# EAGLE design oshi-fuse-board-mk-2_5x20mm (EAGLE 6.5.0)
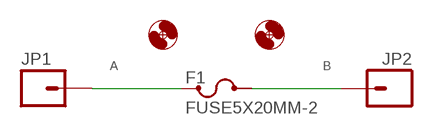
[diagram p0: schematic, sheet 1]

## Parts
F1  FUSE5X20MM-2  [FUSE-2AG]
H1  HOLE#2  [HOLE-#2]
H2  HOLE#2  [HOLE-#2]
JP1  M01SCREWITGOOD  [1X01-RING-TERM-6-32-FAT]
JP2  M01SCREWITGOOD  [1X01-RING-TERM-6-32-FAT]

## Nets
A: F1.1 F1.1@1 JP1.P$1 JP1.P$2 JP1.P$3 JP1.P$4
B: F1.2 F1.2@2 JP2.P$1 JP2.P$2 JP2.P$3 JP2.P$4

## Library data of the parts
F1 = A_butts:FUSE
H1 H2 = A_butts:HOLE: MOUNTING HOLE with drill center marker
JP1 JP2 = A_butts:M01: Header 1 Standard 1-pin 0.1" header. Use with straight break away headers (SKU : PRT-00116), right angle break away headers (PRT-00553), swiss pins (PRT-00743), machine pins (PRT-00117), and female headers (PRT-00115).

## Board
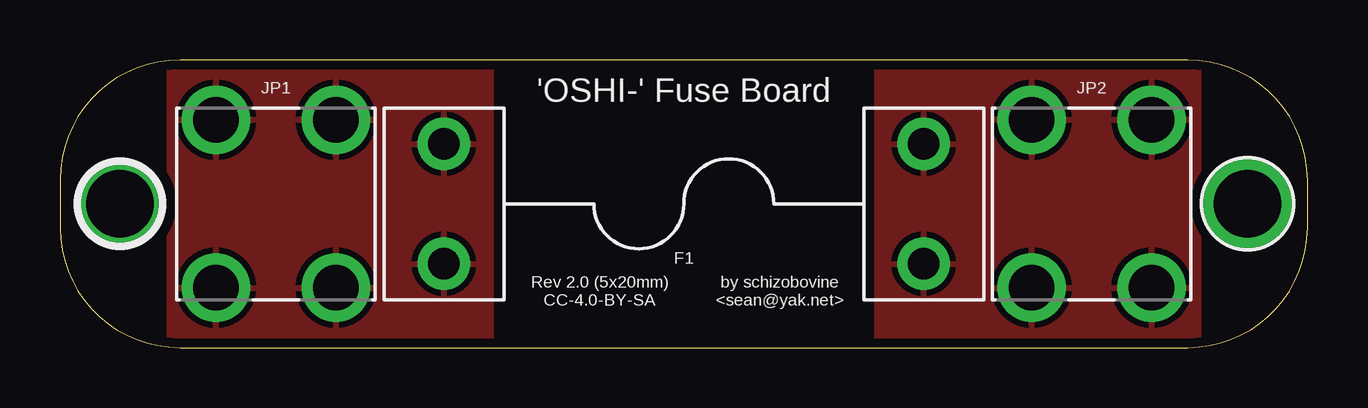
[diagram p1: board, top side]
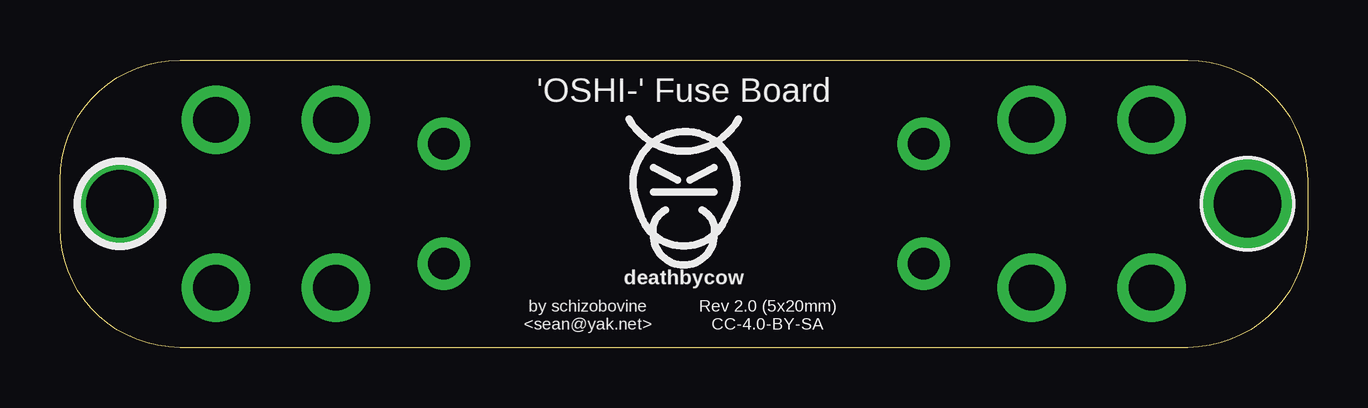
[diagram p2: board, bottom side, seen from below]

Size 52 x 12 mm. Coordinates in mm from the lower left corner, seen from the top.
Outline: 0,7 0,5 arc90 5,0 47,0 arc90 52,5 52,7 arc90 47,12 5,12 arc90 0,7
Copper layers (1*16): Top 0.0356mm / dielectric 1.5011mm / Bottom 0.0356mm
Design rules "LaenPCBOrder_2": minimum track width 6mil, minimum drill 13mil, track to track 6mil, track to pad 6mil, pad to pad 6mil, via to via 6mil, smd to smd 6mil, copper to edge 15mil, drill to drill 6mil, minimum pad ring 7mil, minimum via ring 7mil, stop-mask expansion 3mil, vias tented up to drill 20mil, thermal gap 10mil

### Footprints (pad centres in the part's own frame; a part is rotated, then mirrored left to right if it is on the bottom)
FUSE-2AG = drill 1.3 pad 2.2: 1 -10,2.5; 1@1 -10,-2.5; 2 10,2.5; 2@2 10,-2.5
HOLE-#2 = drill 2.8 pad 3.81: P$1 0,0
1X01-RING-TERM-6-32-FAT = drill 1.9: P$1 -2.5,3.505; P$2 2.5,3.505; P$3 2.5,-3.505; P$4 -2.5,-3.505

### Placement (x,y rotation side)
F1  26,6 0 top
H1  2.5,6 0 top
H2  49.5,6 0 bottom
JP1  9,6 180 top
JP2  43,6 180 top
U$1  [COW_SMALL]  26,7 0 bottom

### Tracks (layer width: path | path; a pad name or v marks a point on that pad's centre or on a via)
A
  pour Top (isolate 0.305): 4.5,12 18,12 18,0 4.5,0
B
  pour Top (isolate 0.305): 34,12 34,0 47.5,0 47.5,12

### Text on the board
tPlace: 'OSHI-' Fuse Board | Rev 2.0 (5x20mm) / CC-4.0-BY-SA | by schizobovine / <sean@yak.net>
bPlace: 'OSHI-' Fuse Board | Rev 2.0 (5x20mm) / CC-4.0-BY-SA | by schizobovine / <sean@yak.net>